# EasyEDA schematic SCH_LEFT_2025-11-04.json
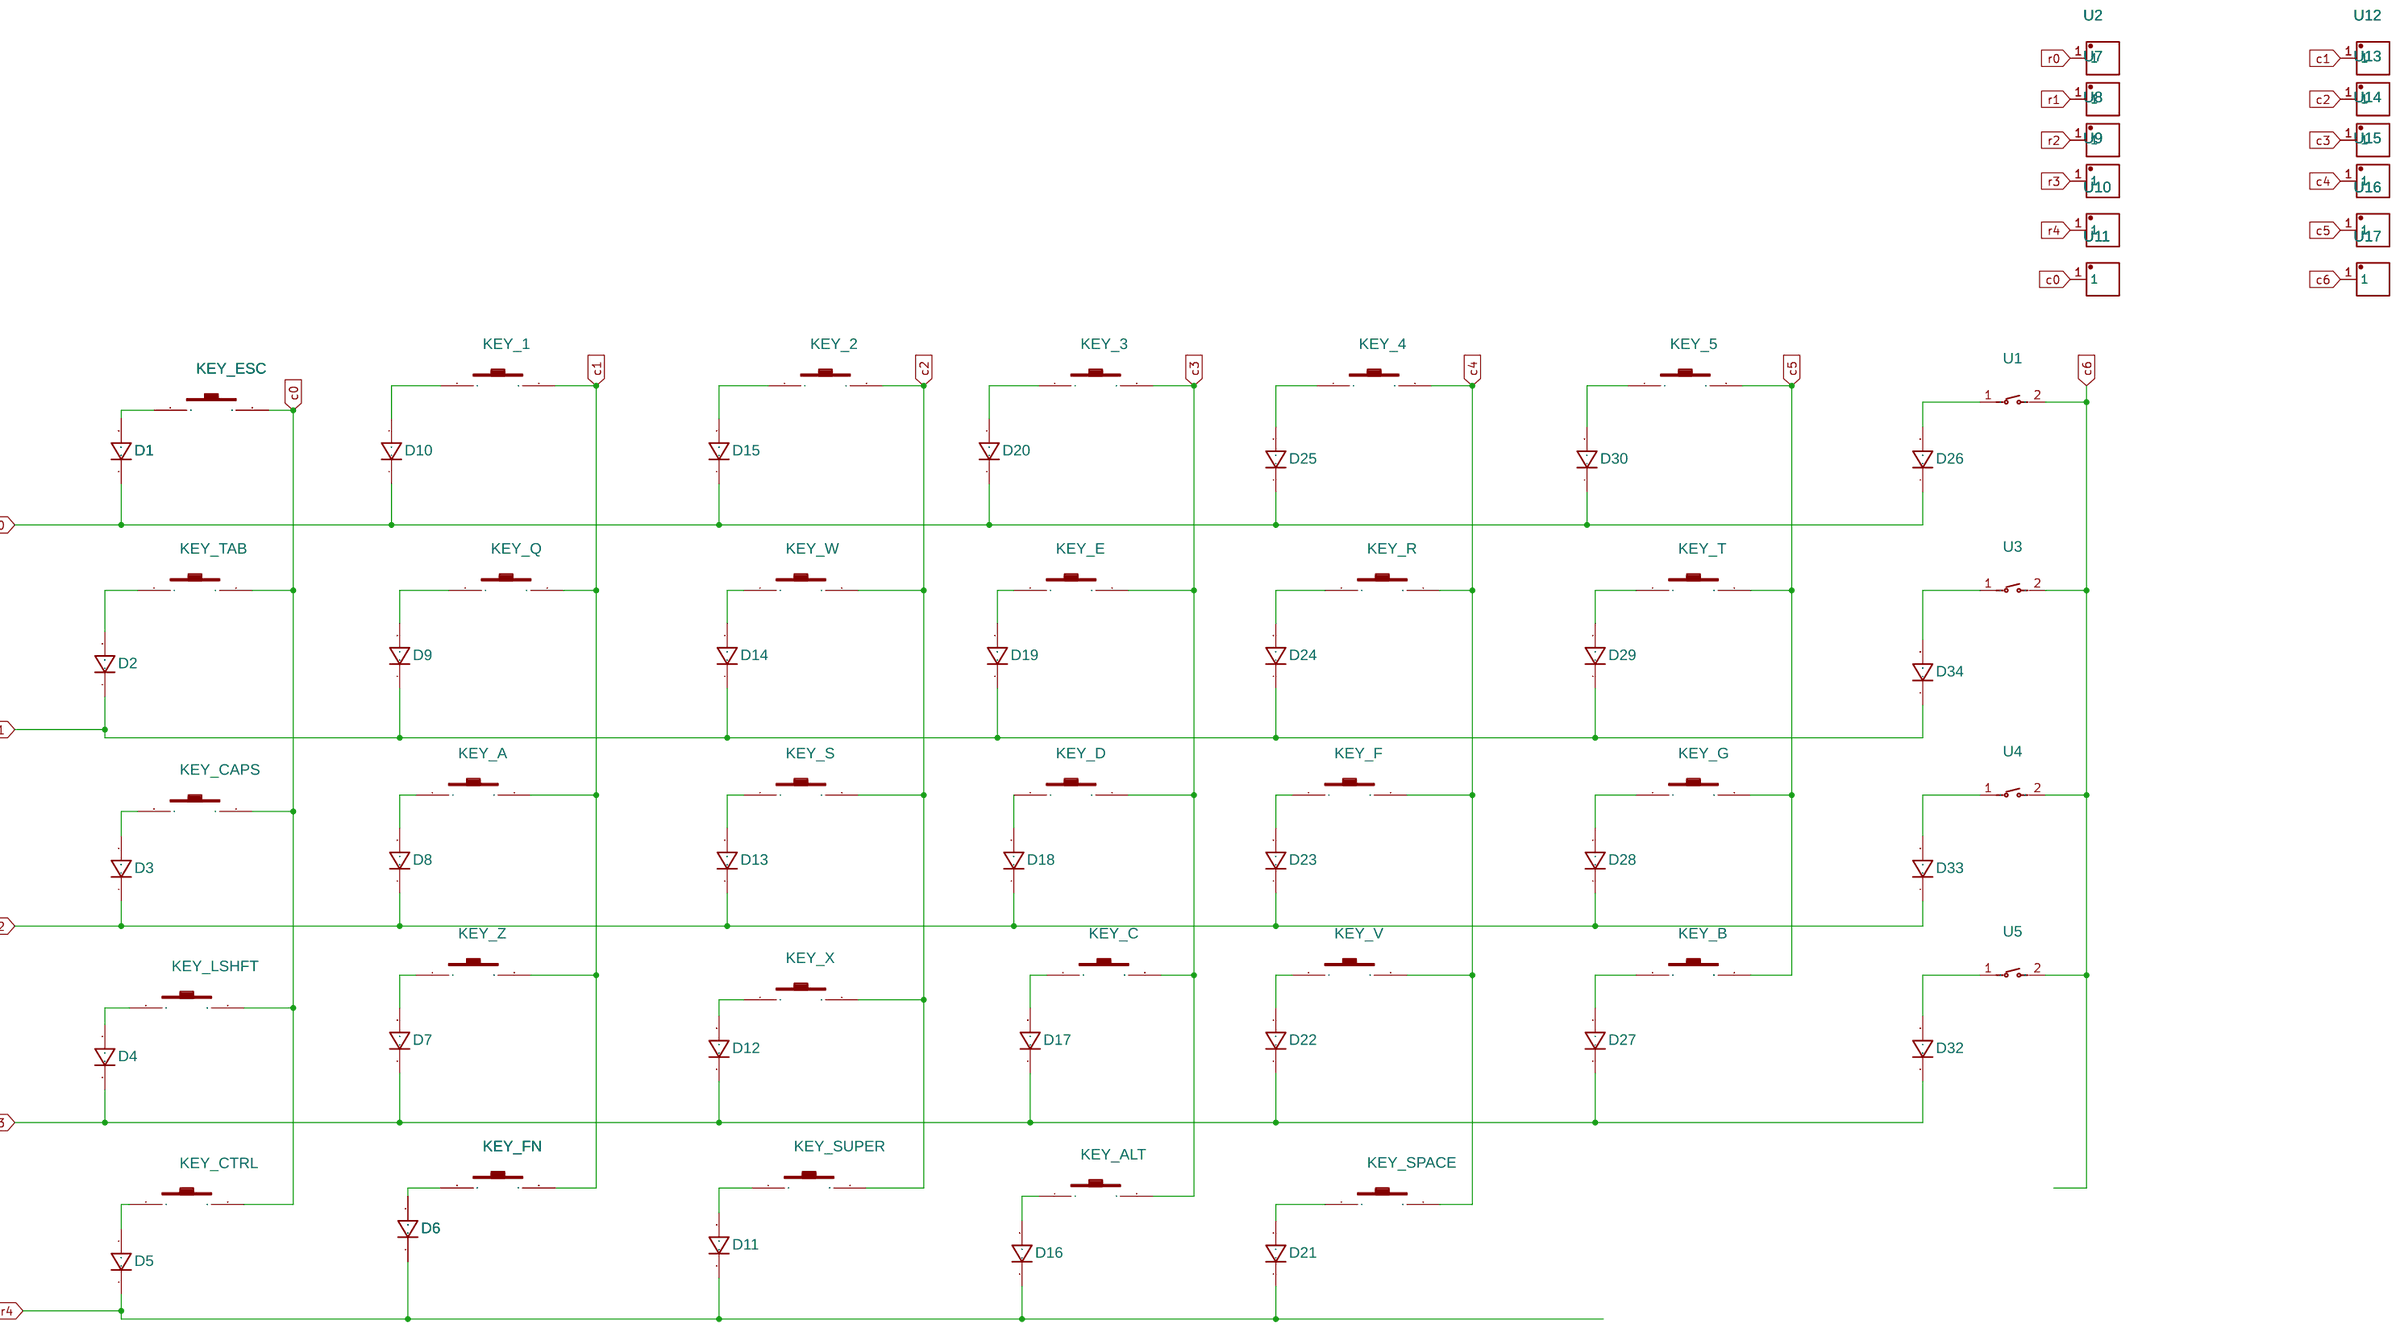
[diagram p0: schematic sheet]

## Parts
D1  1N4148W  [1N4148W]
D2  1N4148W  [1N4148W]
D3  1N4148W  [1N4148W]
D4  1N4148W  [1N4148W]
D5  1N4148W  [1N4148W]
D6  1N4148W  [1N4148W]
D7  1N4148W  [1N4148W]
D8  1N4148W  [1N4148W]
D9  1N4148W  [1N4148W]
D10  1N4148W  [1N4148W]
D11  1N4148W  [1N4148W]
D12  1N4148W  [1N4148W]
D13  1N4148W  [1N4148W]
D14  1N4148W  [1N4148W]
D15  1N4148W  [1N4148W]
D16  1N4148W  [1N4148W]
D17  1N4148W  [1N4148W]
D18  1N4148W  [1N4148W]
D19  1N4148W  [1N4148W]
D20  1N4148W  [1N4148W]
D21  1N4148W  [1N4148W]
D22  1N4148W  [1N4148W]
D23  1N4148W  [1N4148W]
D24  1N4148W  [1N4148W]
D25  1N4148W  [1N4148W]
D26  1N4148W  [1N4148W]
D27  1N4148W  [1N4148W]
D28  1N4148W  [1N4148W]
D29  1N4148W  [1N4148W]
D30  1N4148W  [1N4148W]
D32  1N4148W  [1N4148W]
D33  1N4148W  [1N4148W]
D34  1N4148W  [1N4148W]
KEY_1  Outemu Switch  [KEYBOARD_SWITCH]
KEY_2  Outemu Switch  [KEYBOARD_SWITCH]
KEY_3  Outemu Switch  [KEYBOARD_SWITCH]
KEY_4  Outemu Switch  [KEYBOARD_SWITCH]
KEY_5  Outemu Switch  [KEYBOARD_SWITCH]
KEY_A  Outemu Switch  [KEYBOARD_SWITCH]
KEY_ALT  Outemu Switch  [KEYBOARD_SWITCH]
KEY_B  Outemu Switch  [KEYBOARD_SWITCH]
KEY_C  Outemu Switch  [KEYBOARD_SWITCH]
KEY_CAPS  Outemu Switch  [KEYBOARD_SWITCH]
KEY_CTRL  Outemu Switch  [KEYBOARD_SWITCH]
KEY_D  Outemu Switch  [KEYBOARD_SWITCH]
KEY_E  Outemu Switch  [KEYBOARD_SWITCH]
KEY_ESC  Outemu Switch  [KEYBOARD_SWITCH]
KEY_F  Outemu Switch  [KEYBOARD_SWITCH]
KEY_FN  Outemu Switch  [KEYBOARD_SWITCH]
KEY_G  Outemu Switch  [KEYBOARD_SWITCH]
KEY_LSHFT  Outemu Switch  [KEYBOARD_SWITCH]
KEY_Q  Outemu Switch  [KEYBOARD_SWITCH]
KEY_R  Outemu Switch  [KEYBOARD_SWITCH]
KEY_S  Outemu Switch  [KEYBOARD_SWITCH]
KEY_SPACE  Outemu Switch  [KEYBOARD_SWITCH]
KEY_SUPER  Outemu Switch  [KEYBOARD_SWITCH]
KEY_T  Outemu Switch  [KEYBOARD_SWITCH]
KEY_TAB  Outemu Switch  [KEYBOARD_SWITCH]
KEY_V  Outemu Switch  [KEYBOARD_SWITCH]
KEY_W  Outemu Switch  [KEYBOARD_SWITCH]
KEY_X  Outemu Switch  [KEYBOARD_SWITCH]
KEY_Z  Outemu Switch  [KEYBOARD_SWITCH]
U1  ZX-QC34-2TPDZ  [KEY-SMD_L3.9-W3.0-LS5.0-EH]
U2  54102-T06-00  [HDR-TH_1P-P2.54-V-M]
U3  ZX-QC34-2TPDZ  [KEY-SMD_L3.9-W3.0-LS5.0-EH]
U4  ZX-QC34-2TPDZ  [KEY-SMD_L3.9-W3.0-LS5.0-EH]
U5  ZX-QC34-2TPDZ  [KEY-SMD_L3.9-W3.0-LS5.0-EH]
U7  54102-T06-00  [HDR-TH_1P-P2.54-V-M]
U8  54102-T06-00  [HDR-TH_1P-P2.54-V-M]
U9  54102-T06-00  [HDR-TH_1P-P2.54-V-M]
U10  54102-T06-00  [HDR-TH_1P-P2.54-V-M]
U11  54102-T06-00  [HDR-TH_1P-P2.54-V-M]
U12  54102-T06-00  [HDR-TH_1P-P2.54-V-M]
U13  54102-T06-00  [HDR-TH_1P-P2.54-V-M]
U14  54102-T06-00  [HDR-TH_1P-P2.54-V-M]
U15  54102-T06-00  [HDR-TH_1P-P2.54-V-M]
U16  54102-T06-00  [HDR-TH_1P-P2.54-V-M]
U17  54102-T06-00  [HDR-TH_1P-P2.54-V-M]

## Library data of the parts
D1-D30 D32-D34 = 1N4148W: Manufacturer: SMC Diode Solutions; Supplier: Digi-Key; Supplier Part: 1655-1N4148WCT-ND; link: https://www.digikey.ca/en/products/detail/smc-diode-solutions/1N4148W/6022450; Contributor: Optech
KEY_1-KEY_5 KEY_A KEY_ALT KEY_B KEY_C KEY_CAPS KEY_D KEY_E KEY_ESC KEY_F KEY_FN KEY_G KEY_LSHFT KEY_Q KEY_R KEY_S KEY_SPACE KEY_SUPER KEY_T KEY_TAB KEY_V KEY_W KEY_X KEY_Z = Outemu Switch: Contributor: michal.licht1806
KEY_CTRL = Outemu Switch: Contributor: michal.licht1806; Package Display: No
U1 U3-U5 = ZX-QC34-2TPDZ: Supplier: LCSC; Supplier Part: C7470219; Manufacturer: Megastar(兆星); Contributor: lcsc; JLCPCB Part Class: Extended Part
U2 U7-U17 = 54102-T06-00: Contributor: LCSC; Supplier: LCSC; Supplier Part: C213182; Manufacturer: Amphenol

## Nets
c0: KEY_CAPS.2 KEY_CTRL.2 KEY_ESC.2 KEY_LSHFT.2 KEY_TAB.2 U11.1
c1: KEY_1.2 KEY_A.2 KEY_FN.2 KEY_Q.2 KEY_Z.2 U12.1
c2: KEY_2.2 KEY_S.2 KEY_SUPER.2 KEY_W.2 KEY_X.2 U13.1
c3: KEY_3.2 KEY_ALT.2 KEY_C.2 KEY_D.2 KEY_E.2 U14.1
c4: KEY_4.2 KEY_F.2 KEY_R.2 KEY_SPACE.2 KEY_V.2 U15.1
c5: KEY_5.2 KEY_B.2 KEY_G.2 KEY_T.2 U16.1
c6: U1.2 U3.2 U4.2 U5.2 U17.1
r0: D1.1 D10.1 D15.1 D20.1 D25.1 D26.1 D30.1 U2.1
r1: D2.1 D9.1 D14.1 D19.1 D24.1 D29.1 D34.1 U7.1
r2: D3.1 D8.1 D13.1 D18.1 D23.1 D28.1 D33.1 U8.1
r3: D4.1 D7.1 D12.1 D17.1 D22.1 D27.1 D32.1 U9.1
r4: D5.1 D6.1 D11.1 D16.1 D21.1 U10.1
Net-(D1-2): D1.2 KEY_ESC.1
Net-(D2-2): D2.2 KEY_TAB.1
Net-(D3-2): D3.2 KEY_CAPS.1
Net-(D4-2): D4.2 KEY_LSHFT.1
Net-(D5-2): D5.2 KEY_CTRL.1
Net-(D6-2): D6.2 KEY_FN.1
Net-(D7-2): D7.2 KEY_Z.1
Net-(D8-2): D8.2 KEY_A.1
Net-(D9-2): D9.2 KEY_Q.1
Net-(D10-2): D10.2 KEY_1.1
Net-(D11-2): D11.2 KEY_SUPER.1
Net-(D12-2): D12.2 KEY_X.1
Net-(D13-2): D13.2 KEY_S.1
Net-(D14-2): D14.2 KEY_W.1
Net-(D15-2): D15.2 KEY_2.1
Net-(D16-2): D16.2 KEY_ALT.1
Net-(D17-2): D17.2 KEY_C.1
Net-(D18-2): D18.2 KEY_D.1
Net-(D19-2): D19.2 KEY_E.1
Net-(D20-2): D20.2 KEY_3.1
Net-(D21-2): D21.2 KEY_SPACE.1
Net-(D22-2): D22.2 KEY_V.1
Net-(D23-2): D23.2 KEY_F.1
Net-(D24-2): D24.2 KEY_R.1
Net-(D25-2): D25.2 KEY_4.1
Net-(D26-2): D26.2 U1.1
Net-(D27-2): D27.2 KEY_B.1
Net-(D28-2): D28.2 KEY_G.1
Net-(D29-2): D29.2 KEY_T.1
Net-(D30-2): D30.2 KEY_5.1
Net-(D32-2): D32.2 U5.1
Net-(D33-2): D33.2 U4.1
Net-(D34-2): D34.2 U3.1
